# EAGLE schematic MSGEQ7 (EAGLE 7.2.0)
CNAME: MSGEQ7 Breakout Board; CREVISION: 1.0; DESIGNER: NicoHood
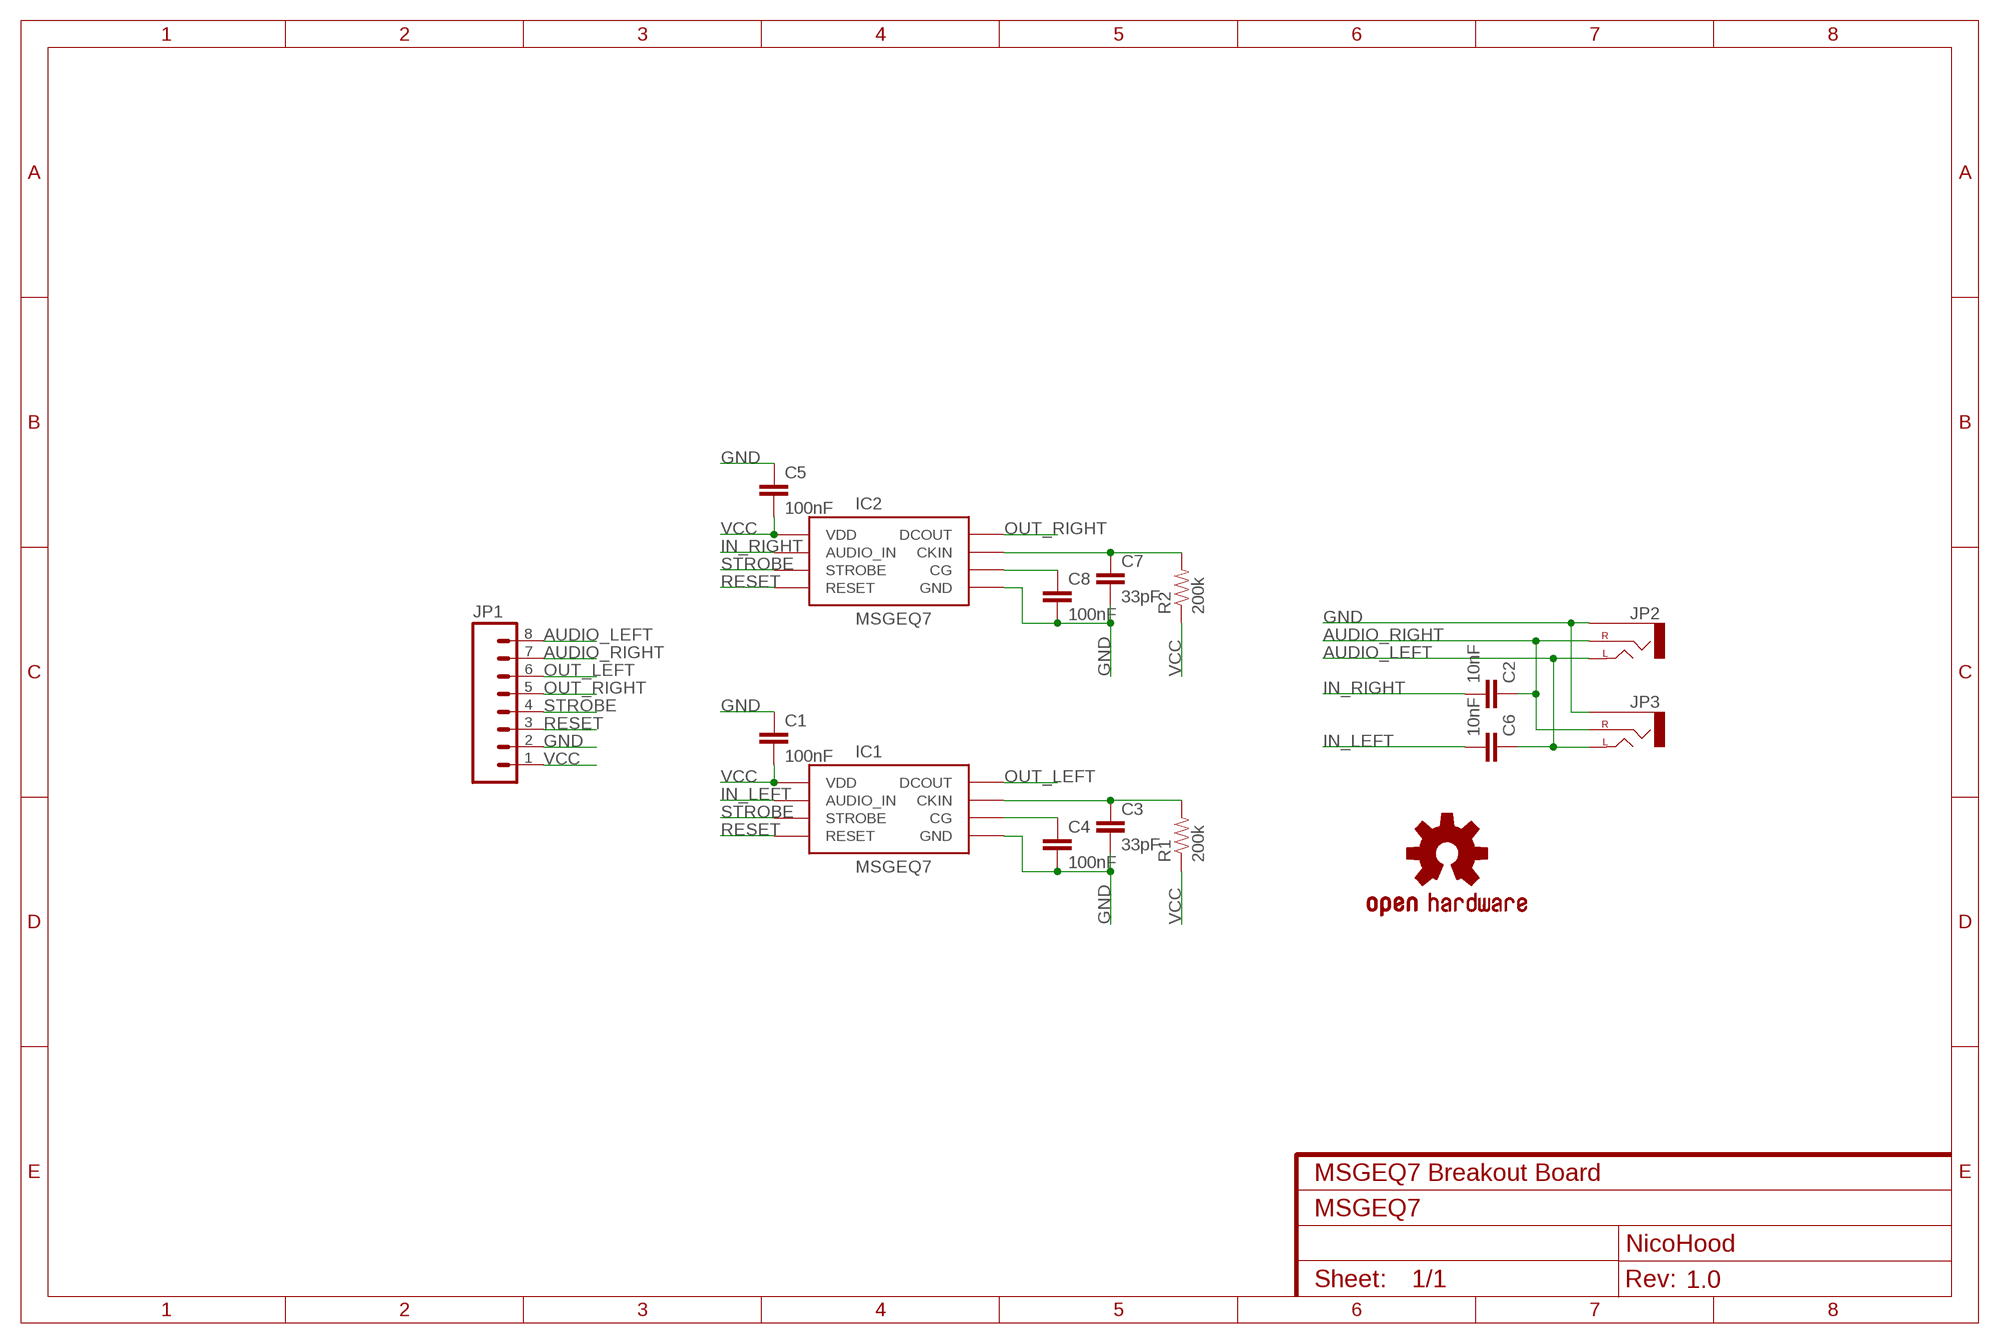
[diagram p0: schematic, sheet 1]

## Parts
C1  100nF  CAPPTH  [CAP-PTH-SMALL]
C2  10nF  CAPPTH  [CAP-PTH-SMALL]
C3  33pF  CAPPTH  [CAP-PTH-SMALL]
C4  100nF  CAPPTH  [CAP-PTH-SMALL]
C5  100nF  CAPPTH  [CAP-PTH-SMALL]
C6  10nF  CAPPTH  [CAP-PTH-SMALL]
C7  33pF  CAPPTH  [CAP-PTH-SMALL]
C8  100nF  CAPPTH  [CAP-PTH-SMALL]
IC1  MSGEQ7DIL  [DIL-08]
IC2  MSGEQ7DIL  [DIL-08]
JP1  M08SILK_FEMALE_PTH  [1X08]
JP2  AUDIO-JACKPTH  [AUDIO-JACK]
JP3  AUDIO-JACKPTH  [AUDIO-JACK]
LOGO1  OSHW-LOGOS  [OSHW-LOGO-S]
R1  200k  RESISTORPTH-1/4W  [AXIAL-0.4]
R2  200k  RESISTORPTH-1/4W  [AXIAL-0.4]

## Nets
AUDIO_LEFT: C6.1 JP1.8 JP2.TIP(LEFT) JP3.TIP(LEFT)
AUDIO_RIGHT: C2.1 JP1.7 JP2.RING(RIGHT) JP3.RING(RIGHT)
GND: C1.1 C3.2 C4.2 C5.1 C7.2 C8.2 IC1.2(GND) IC2.2(GND) JP1.2 JP2.SLEEVE JP3.SLEEVE
IN_LEFT: C6.2 IC1.5(AUDIO_IN)
IN_RIGHT: C2.2 IC2.5(AUDIO_IN)
N$9: C8.1 IC2.6(CG)
N$10: C7.1 IC2.8(CKIN) R2.P$2
N$11: C3.1 IC1.8(CKIN) R1.P$2
N$12: C4.1 IC1.6(CG)
OUT_LEFT: IC1.3(DCOUT) JP1.6
OUT_RIGHT: IC2.3(DCOUT) JP1.5
RESET: IC1.7(RESET) IC2.7(RESET) JP1.3
STROBE: IC1.4(STROBE) IC2.4(STROBE) JP1.4
VCC: C1.2 C5.2 IC1.1(VDD) IC2.1(VDD) JP1.1 R1.P$1 R2.P$1

## Library data of the parts
C1-C8 = SparkFun-Capacitors:CAP: Capacitor Standard 0603 ceramic capacitor, and 0.1" leaded capacitor.
IC1 IC2 = SparkFun-AnalogIC:MSGEQ7: 7-band graphic equalizer
JP1 = SparkFun-Connectors:M08: Header 8 Standard 8-pin 0.1" header. Use with straight break away headers (SKU : PRT-00116), right angle break away headers (PRT-00553), swiss pins (PRT-00743), machine pins (PRT-00117), and female headers (PRT-00115).; PROD_ID: CONN-08438
JP2 JP3 = SparkFun-Connectors:AUDIO-JACK: 3.5mm Audio Jack Simple 3.5mm common PCB mount audio jack. Variant PTH is our storefront SKU PRT-08032
LOGO1 = SparkFun-Aesthetics:OSHW-LOGO: Open Source Hardware Logo This logo indicates the piece of hardware it is found on incorporates a OSHW license and/or adheres to the definition of open source hardware found here: http://freedomdefined.org/OSHW
R1 R2 = SparkFun-Passives:RESISTOR: Resistor Basic schematic elements and footprints for 0603, 1206, and PTH resistors.